# Altium schematic sheet LCD_ILI9341.SchDoc
size A4
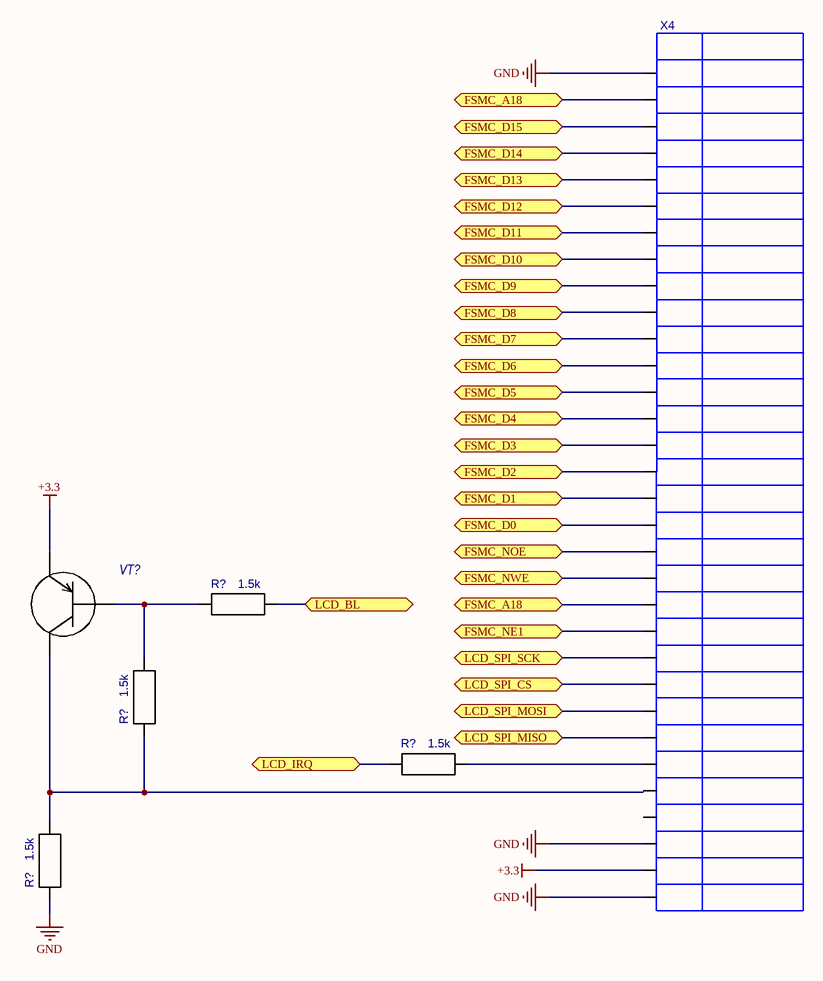
[diagram p0: LCD_ILI9341.SchDoc]

## Parts
(Parts that share a designator on the sheet are numbered #1, #2 ... from top to bottom, then left to right.)
R?#1  1.5k  [RES_0805]
R?#2  1.5k  [RES_0805]
R?#3  1.5k  [RES_0805]
R?#4  1.5k  [RES_0805]
VT?  (no value)
X4  LCD-MODULE  [LCD-MODULE-3.2-480-320]  (value not drawn)

## Ports
FSMC_A18 (bidir), FSMC_D0 (bidir), FSMC_D1 (bidir), FSMC_D2 (bidir), FSMC_D3 (bidir), FSMC_D4 (bidir), FSMC_D5 (bidir), FSMC_D6 (bidir), FSMC_D7 (bidir), FSMC_D8 (bidir), FSMC_D9 (bidir), FSMC_D10 (bidir), FSMC_D11 (bidir), FSMC_D12 (bidir), FSMC_D13 (bidir), FSMC_D14 (bidir), FSMC_D15 (bidir), FSMC_NE1 (bidir), FSMC_NOE (bidir), FSMC_NWE (bidir), LCD_BL (bidir), LCD_IRQ (bidir), LCD_SPI_CS (bidir), LCD_SPI_MISO (bidir), LCD_SPI_MOSI (bidir), LCD_SPI_SCK (bidir)

## Nets
+3.3: VT?.E X4.31
GND: R?#4.2 X4.1 X4.30 X4.32
FSMC_A18: X4.2 X4.21 ; port FSMC_A18
FSMC_D0: X4.18 ; port FSMC_D0
FSMC_D1: X4.17 ; port FSMC_D1
FSMC_D2: X4.16 ; port FSMC_D2
FSMC_D3: X4.15 ; port FSMC_D3
FSMC_D4: X4.14 ; port FSMC_D4
FSMC_D5: X4.13 ; port FSMC_D5
FSMC_D6: X4.12 ; port FSMC_D6
FSMC_D7: X4.11 ; port FSMC_D7
FSMC_D8: X4.10 ; port FSMC_D8
FSMC_D9: X4.9 ; port FSMC_D9
FSMC_D10: X4.8 ; port FSMC_D10
FSMC_D11: X4.7 ; port FSMC_D11
FSMC_D12: X4.6 ; port FSMC_D12
FSMC_D13: X4.5 ; port FSMC_D13
FSMC_D14: X4.4 ; port FSMC_D14
FSMC_D15: X4.3 ; port FSMC_D15
FSMC_NE1: X4.22 ; port FSMC_NE1
FSMC_NOE: X4.19 ; port FSMC_NOE
FSMC_NWE: X4.20 ; port FSMC_NWE
LCD_BL: R?#1.1 ; port LCD_BL
LCD_IRQ: R?#3.2 ; port LCD_IRQ
LCD_SPI_CS: X4.24 ; port LCD_SPI_CS
LCD_SPI_MISO: X4.26 ; port LCD_SPI_MISO
LCD_SPI_MOSI: X4.25 ; port LCD_SPI_MOSI
LCD_SPI_SCK: X4.23 ; port LCD_SPI_SCK
NetR?#1_2: R?#1.2 R?#2.1 VT?.B
NetR?#2_2: R?#2.2 R?#4.1 VT?.C
NetR?#3_1: R?#3.1 X4.27

Not connected (* = marked no-connect by the designer): X4 28 29

## Library data of the parts
R?#1-R?#4 = RES_0805: Value: *
VT? = TRANS-PNP
X4 = LCD-MODULE: LCD-MODULE_3'2; Value: *